# Altium schematic sheet 03_MCU_ESP32_Interface.SchDoc
size A4; SheetNumber: 4; SheetTotal: 9
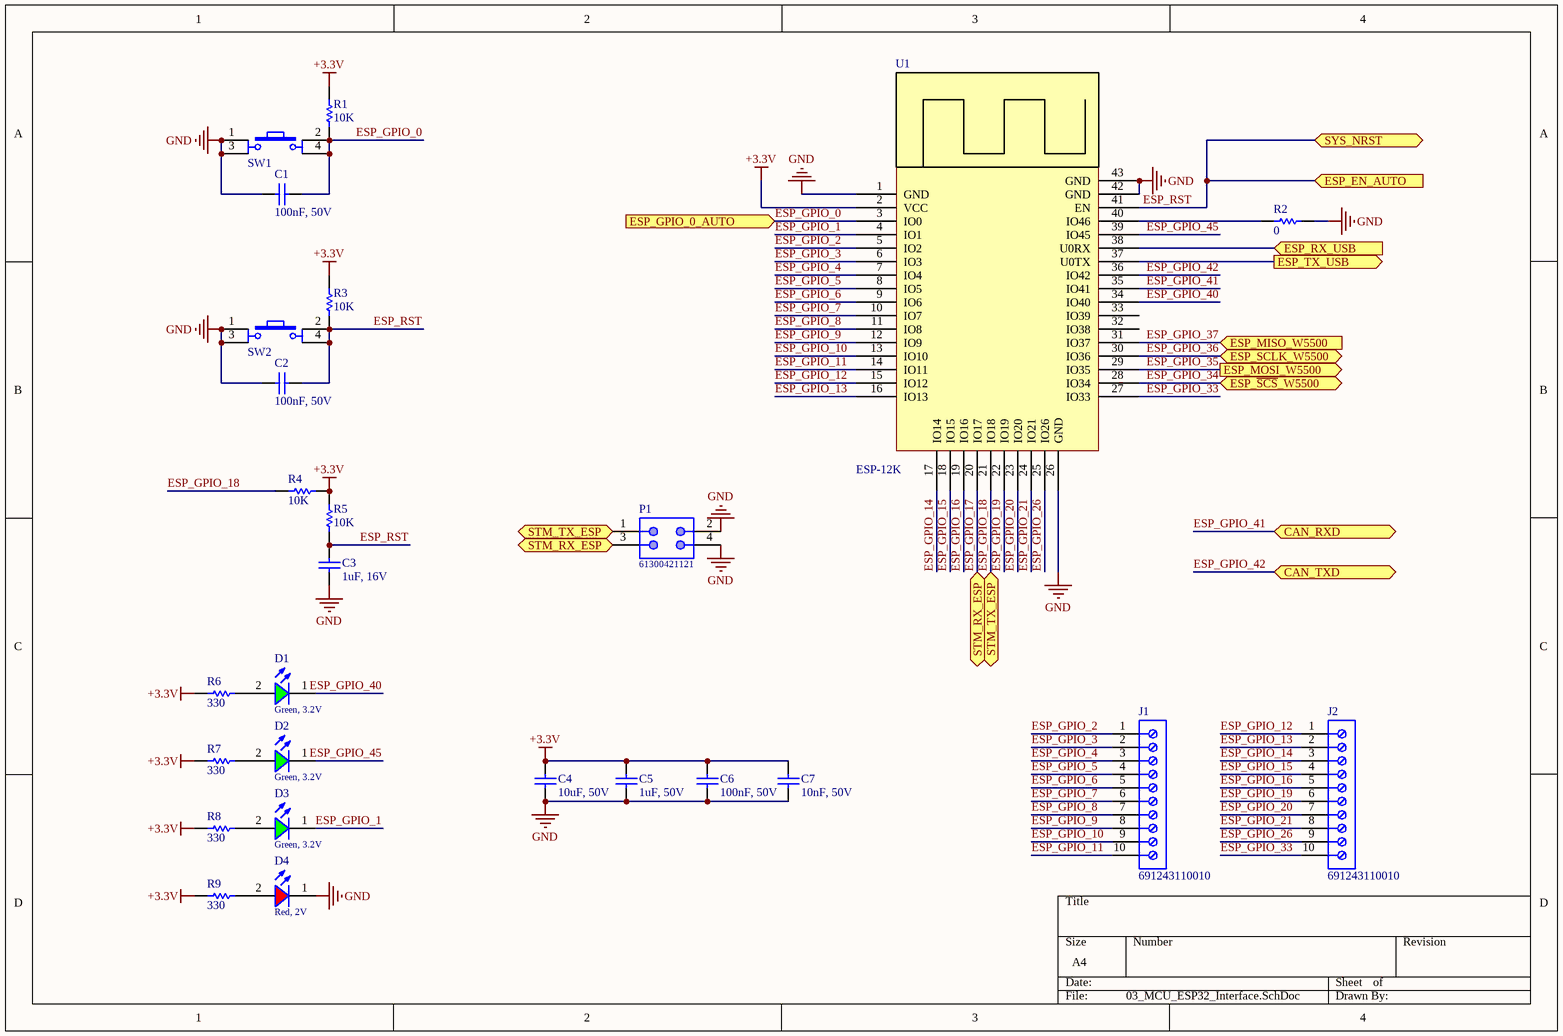
[diagram p0: 03_MCU_ESP32_Interface.SchDoc]

## Parts
C1  100nF, 50V  [WCAP-CSGP_0603_H=0.8mm_Reflow]
C2  100nF, 50V  [WCAP-CSGP_0603_H=0.8mm_Reflow]
C3  1uF, 16V  [WCAP-CSGP_0603_H=0.8mm_Reflow]
C4  10uF, 50V  [WCAP-CSGP_0603_H=0.8mm_Reflow]
C5  1uF, 50V  [WCAP-CSGP_0603_H=0.8mm_Reflow]
C6  100nF, 50V  [WCAP-CSGP_0603_H=0.8mm_Reflow]
C7  10nF, 50V  [WCAP-CSGP_0603_H=0.8mm_Reflow]
D1  Green, 3.2V  [WL-SMCW_0603_H=0.7mm]
D2  Green, 3.2V  [WL-SMCW_0603_H=0.7mm]
D3  Green, 3.2V  [WL-SMCW_0603_H=0.7mm]
D4  Red, 2V  [WL-SMCW_0603_H=0.7mm]
J1  691243110010  [691243110010]
J2  691243110010  [691243110010]
P1  61300421121  [61300421121]
R1  value 10K  [RES-SM-0603]  (hidden comment: RESISTOR SMD)
R2  value 0  [RES-SM-0603]  (hidden comment: RESISTOR SMD)
R3  value 10K  [RES-SM-0603]  (hidden comment: RESISTOR SMD)
R4  value 10K  [RES-SM-0603]  (hidden comment: RESISTOR SMD)
R5  value 10K  [RES-SM-0603]  (hidden comment: RESISTOR SMD)
R6  value 330  [RES-SM-0603]  (hidden comment: RESISTOR SMD)
R7  value 330  [RES-SM-0603]  (hidden comment: RESISTOR SMD)
R8  value 330  [RES-SM-0603]  (hidden comment: RESISTOR SMD)
R9  value 330  [RES-SM-0603]  (hidden comment: RESISTOR SMD)
SW1  SW  [Tact SW 4 pin]  (value not drawn)
SW2  SW  [Tact SW 4 pin]  (value not drawn)
U1  ESP-12K  [CAC-150P3100X1800-41N]

## Ports
CAN_RXD (bidir), CAN_TXD (bidir), ESP_EN_AUTO (in), ESP_GPIO_0_AUTO (in), ESP_MISO_W5500 (in), ESP_MOSI_W5500 (out), ESP_RX_USB (in), ESP_SCLK_W5500 (bidir), ESP_TX_USB (out), ESP_~{SCS}_W5500 (bidir), STM_RX_ESP (bidir), STM_TX_ESP (bidir), SYS_NRST (bidir)

## Nets
+3.3V: C4.2 C5.2 C6.2 C7.2 R1.2 R3.2 R4.2 R5.2 R6.2 R7.2 R8.2 R9.2 U1.2(VCC)
GND: C1.1 C2.1 C3.1 C4.1 C5.1 C6.1 C7.1 D4.1(K) P1.2 P1.4 R2.2 SW1.1 SW1.3 SW2.1 SW2.3 U1.1(GND) U1.26(GND) U1.42(GND) U1.43(GND)
ESP_GPIO_0: C1.2 R1.1 SW1.2 SW1.4 U1.3(IO0) ; port ESP_GPIO_0_AUTO
ESP_GPIO_1: D3.1(K) U1.4(IO1)
ESP_GPIO_2: J1.1 U1.5(IO2)
ESP_GPIO_3: J1.2 U1.6(IO3)
ESP_GPIO_4: J1.3 U1.7(IO4)
ESP_GPIO_5: J1.4 U1.8(IO5)
ESP_GPIO_6: J1.5 U1.9(IO6)
ESP_GPIO_7: J1.6 U1.10(IO7)
ESP_GPIO_8: J1.7 U1.11(IO8)
ESP_GPIO_9: J1.8 U1.12(IO9)
ESP_GPIO_10: J1.9 U1.13(IO10)
ESP_GPIO_11: J1.10 U1.14(IO11)
ESP_GPIO_12: J2.1 U1.15(IO12)
ESP_GPIO_13: J2.2 U1.16(IO13)
ESP_GPIO_14: J2.3 U1.17(IO14)
ESP_GPIO_15: J2.4 U1.18(IO15)
ESP_GPIO_16: J2.5 U1.19(IO16)
ESP_GPIO_17: P1.3 U1.20(IO17) ; port STM_RX_ESP
ESP_GPIO_18: P1.1 R4.1 U1.21(IO18) ; port STM_TX_ESP
ESP_GPIO_19: J2.6 U1.22(IO19)
ESP_GPIO_20: J2.7 U1.23(IO20)
ESP_GPIO_21: J2.8 U1.24(IO21)
ESP_GPIO_26: J2.9 U1.25(IO26)
ESP_GPIO_33: J2.10 U1.27(IO33)
ESP_GPIO_34: U1.28(IO34) ; port ESP_~{SCS}_W5500
ESP_GPIO_35: U1.29(IO35) ; port ESP_MOSI_W5500
ESP_GPIO_36: U1.30(IO36) ; port ESP_SCLK_W5500
ESP_GPIO_37: U1.31(IO37) ; port ESP_MISO_W5500
ESP_GPIO_40: D1.1(K) U1.34(IO40)
ESP_GPIO_41: U1.35(IO41) ; port CAN_RXD
ESP_GPIO_42: U1.36(IO42) ; port CAN_TXD
ESP_GPIO_45: D2.1(K) U1.39(IO45)
ESP_RST: C2.2 C3.2 R3.1 R5.1 SW2.2 SW2.4 U1.41(EN) ; port ESP_EN_AUTO, port SYS_NRST
ESP_RX_USB: U1.38(U0RX) ; port ESP_RX_USB
ESP_TX_USB: U1.37(U0TX) ; port ESP_TX_USB
NetD1_2: D1.2(A) R6.1
NetD2_2: D2.2(A) R7.1
NetD3_2: D3.2(A) R8.1
NetD4_2: D4.2(A) R9.1
NetR2_1: R2.1 U1.40(IO46)

Not connected (* = marked no-connect by the designer): U1 32(IO38) 33(IO39)

## Library data of the parts
C1 C2 C4-C6 = 885012206095: WCAP-CSGP Multilayer Ceramic Chip Capacitor, General Purpose, size 0603, X7R, 100nF, 50V; Manufacturer: Wurth Elektronik; Rated Voltage: 50VDC; Isolation Resistance: >=5GOhm; Capacitance Tolerance: +/-10%; Technical Reference: X7R0603104K050DFCT10000; ComponentLink1Description: Manufacturer; ComponentLink1URL: http://www.we-online.de; ComponentLink2Description: Datasheet; ComponentLink2URL: https://www.we-online.com/catalog/datasheet/885012206095.pdf; Operating Temperature: -55 to +125degC; Packaging: Tape and Reel; Manufacturer Part Number: 885012206095; Published Date: May 2020; Ceramic Type: X7R; Dissipation Factor: =<3%; Height: 0.8mm; Mounting Technology: SMT; Size: 0603; Capacitance: 100nF
C3 = 885012106017: WCAP-CSGP Multilayer Ceramic Chip Capacitor, General Purpose, size 0603, X5R, 1uF, 16V; Manufacturer: Wurth Elektronik; Rated Voltage: 16VDC; Isolation Resistance: >=0.1GOhm; Capacitance Tolerance: +/-20%; Technical Reference: X5R0603105M016DFCT10000; ComponentLink1Description: Manufacturer; ComponentLink1URL: http://www.we-online.de; ComponentLink2Description: Datasheet; ComponentLink2URL: https://www.we-online.com/catalog/datasheet/885012106017.pdf; Operating Temperature: -55 to +85degC; Packaging: Tape and Reel; Manufacturer Part Number: 885012106017; Published Date: May 2020; Ceramic Type: X5R; Dissipation Factor: =<10%; Height: 0.8mm; Mounting Technology: SMT; Size: 0603; Capacitance: 1uF
C7 = 885012206089: WCAP-CSGP Multilayer Ceramic Chip Capacitor, General Purpose, size 0603, X7R, 10nF, 50V; Manufacturer: Wurth Elektronik; Rated Voltage: 50VDC; Isolation Resistance: >=10GOhm; Capacitance Tolerance: +/-10%; Technical Reference: X7R0603103K050DFCT10000; ComponentLink1Description: Manufacturer; ComponentLink1URL: http://www.we-online.de; ComponentLink2Description: Datasheet; ComponentLink2URL: https://www.we-online.com/catalog/datasheet/885012206089.pdf; Operating Temperature: -55 to +125degC; Packaging: Tape and Reel; Manufacturer Part Number: 885012206089; Published Date: May 2020; Ceramic Type: X7R; Dissipation Factor: =<2.5%; Height: 0.8mm; Mounting Technology: SMT; Size: 0603; Capacitance: 10nF
D1-D3 = 150060GS75000: WL-SMCW SMT Mono-color Chip LED Waterclear, size 0603, Green, 3.2V, 140deg; Chip Technology: InGaN; Dominant Wavelength typ.: 525nm; Luminous Intensity typ.: 430mcd; Peak Wavelength typ.: 515nm; Viewing Angle: 140deg; ComponentLink1Description: Manufacturer; ComponentLink1URL: http://www.we-online.de; ComponentLink2URL: https://www.we-online.com/catalog/datasheet/150060GS75000.pdf; ComponentLink2Description: Datasheet; Forward Voltage typ.: 3.2V; Emitting Color: Green; Mounting Technology: SMT; Operating Temperature: -40 to +85degC; Published Date: December 2019; Part Number: 150060GS75000; Packaging: Tape and Reel; Size: 0603; Publisher: Wurth Elektronik
D4 = 150060RS75000: WL-SMCW SMT Mono-color Chip LED Waterclear, size 0603, Red, 2V, 140deg; Chip Technology: AlInGaP; Dominant Wavelength typ.: 625nm; Luminous Intensity typ.: 250mcd; Peak Wavelength typ.: 630nm; Viewing Angle: 140deg; ComponentLink1Description: Manufacturer; ComponentLink1URL: http://www.we-online.de; ComponentLink2URL: https://www.we-online.com/catalog/datasheet/150060RS75000.pdf; ComponentLink2Description: Datasheet; Forward Voltage typ.: 2V; Emitting Color: Red; Mounting Technology: SMT; Operating Temperature: -40 to +85degC; Published Date: December 2019; Part Number: 150060RS75000; Packaging: Tape and Reel; Size: 0603; Publisher: Wurth Elektronik
J1 J2 = 691243110010: WR-TBL Serie 2431 Horizontal Cable Entry, Rising Cage Clamp, pitch 3.5mm, 10p; Compliance: Lead free / RoHS; Modularity: No; PCB/Cable/Panel: PCB; Pin Number: 10; Rated Current [UL]: 10A; Working Voltage [UL]: 300VAC; ComponentLink1Description: Manufacturer; ComponentLink1URL: http://www.we-online.de; ComponentLink2URL: https://katalog.we-online.de/em/datasheet/691243110010.pdf; ComponentLink2Description: Datasheet; Mounting Technology: THT; Part Number: 691243110010; Packaging: Box; Operating Temperature: -30 to +120degC; Pitch: 3.5mm; Published Date: October 2019; Type: Horizontal; Publisher: Wurth Elektronik; Application: Rising Cage Clamp
P1 = 61300421121: WR-PHD Pin Header, THT, pitch 2.54mm, Dual Row, Vertical, 4p; Manufacturer: Wurth Elektronik; Pin Number: 4; Rated Current: 3A; Working Voltage: 250VAC; Withstanding Voltage: 500VAC; Contact Resistance: 20mOhm; ComponentLink1Description: Manufacturer; ComponentLink1URL: http://www.we-online.de; ComponentLink2Description: Datasheet; ComponentLink2URL: https://www.we-online.com/catalog/datasheet/61300421121.pdf; Manufacturer Part Number: 61300421121; Published Date: May 2020; Pitch: 2.54mm; Operating Temperature: -40 to +105degC; Mounting Technology: THT; Packaging: Bag; Gender: Pin Header; Row Number: Dual; Orientation: Vertical
R1-R9 = RESISTOR SMD: Resistor
SW1 SW2 = Tact SW - 4Pin: Switch button 4 pin; Value: Button chip 4 pin
U1 = ESP-12K: ESP32-S2